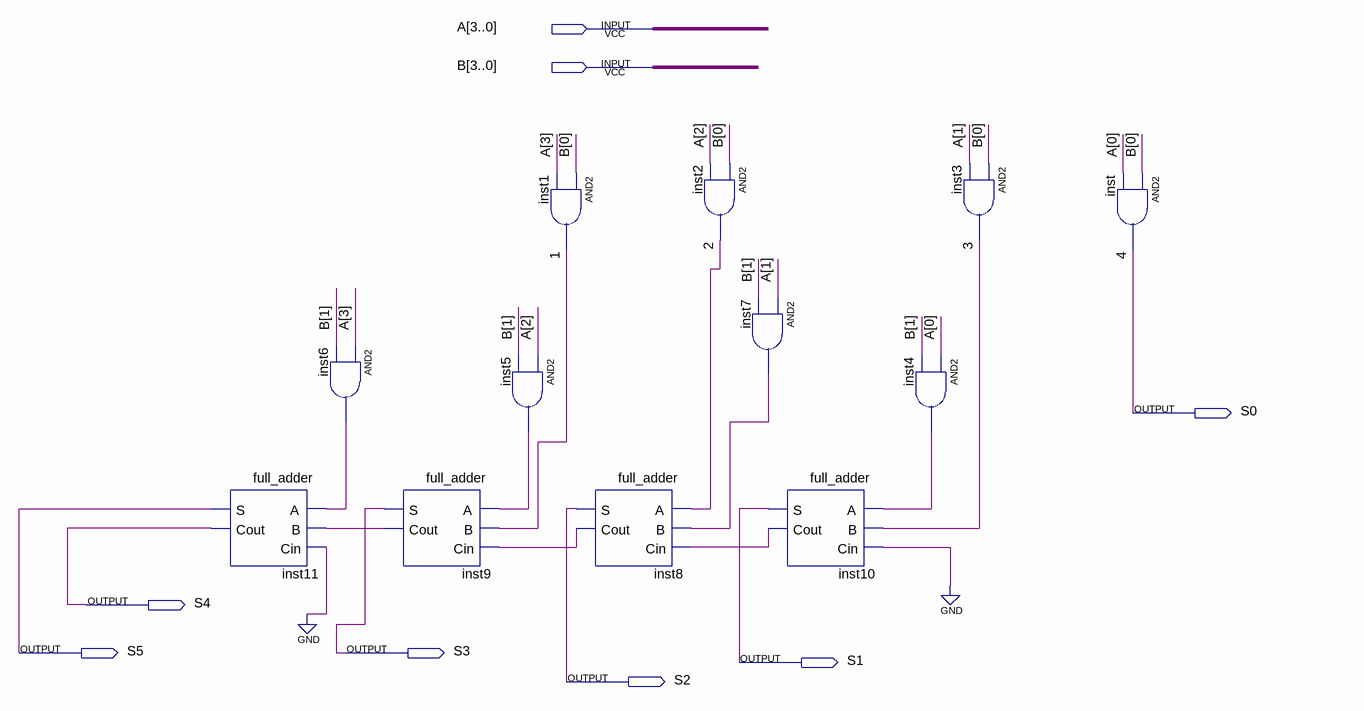
[diagram p0: schematic sheet]
// Quartus schematic LEVEL_1.bdf as structural Verilog: 12 symbols, 8 pins
module LEVEL_1 (
  input  [3:0] A,
  input  [3:0] B,
  output S0,
  output S4,
  output S5,
  output S3,
  output S1,
  output S2
);

  wire \1 , \2 , \3 , inst4_out, inst5_out, inst6_out, inst7_out, inst8_cout, inst9_cout, inst10_cout;

  full_adder inst11 (.A(inst6_out), .B(inst9_cout), .Cin(1'b0), .S(S5), .Cout(S4));
  and inst6 (inst6_out, A[3], B[1]);
  full_adder inst9 (.A(inst5_out), .B(\1 ), .Cin(inst8_cout), .S(S3), .Cout(inst9_cout));
  and inst5 (inst5_out, A[2], B[1]);
  and inst1 (\1 , B[0], A[3]);
  full_adder inst8 (.A(\2 ), .B(inst7_out), .Cin(inst10_cout), .S(S2), .Cout(inst8_cout));
  and inst2 (\2 , B[0], A[2]);
  and inst7 (inst7_out, A[1], B[1]);
  full_adder inst10 (.A(inst4_out), .B(\3 ), .Cin(1'b0), .S(S1), .Cout(inst10_cout));
  and inst4 (inst4_out, A[0], B[1]);
  and inst3 (\3 , B[0], A[1]);
  and inst (S0, B[0], A[0]);

  // Other names for the same wires on the sheet: 4 = S0
endmodule
